# Altium schematic sheet ft600.SchDoc
size A4
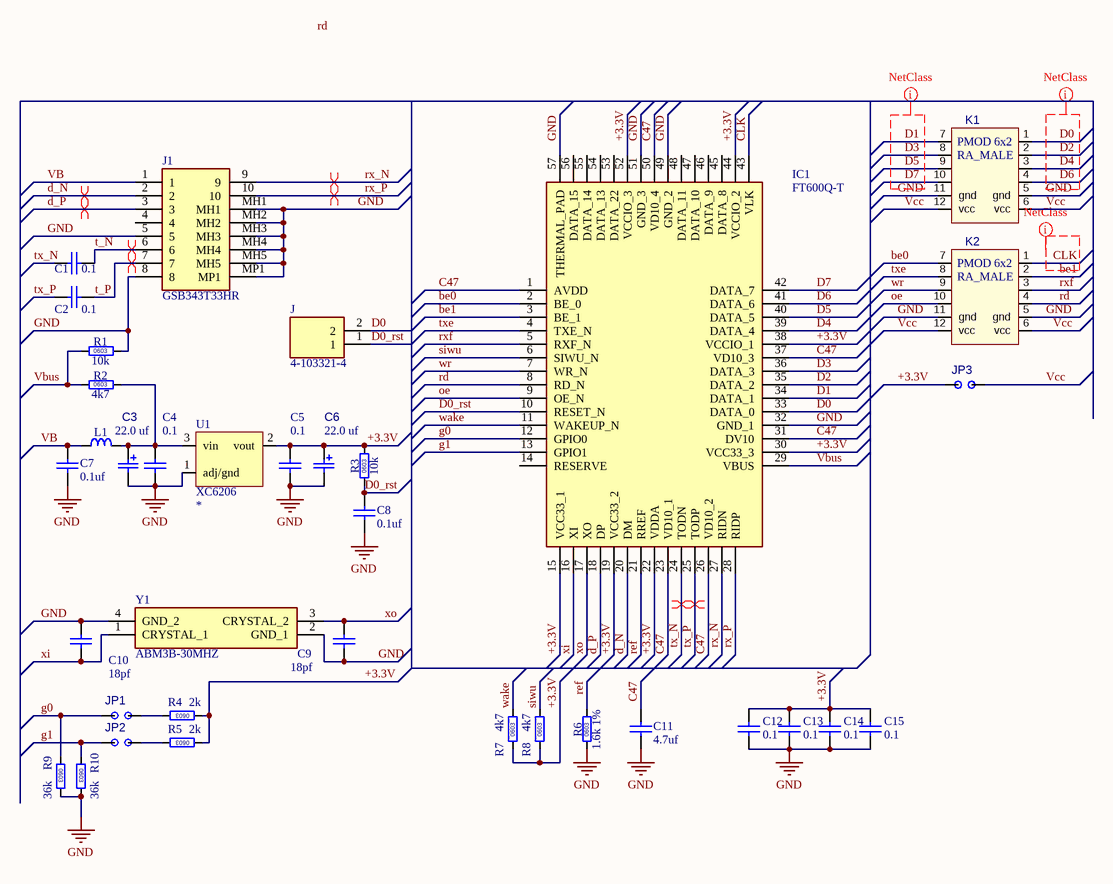
[diagram p0: ft600.SchDoc]

## Parts
C1  value 0.1  [SM0402_3D_cap]  (hidden comment: cap0402)
C2  value 0.1  [SM0402_3D_cap]  (hidden comment: cap0402)
C3  CAP_POL_SMA  [CAP_POL_SMA (3216)]  (value not drawn)
C4  value 0.1  [SM0603 _3D_cap]  (hidden comment: cap0603)
C5  value 0.1  [SM0603 _3D_cap]  (hidden comment: cap0603)
C6  CAP_POL_SMA  [CAP_POL_SMA (3216)]  (value not drawn)
C7  value 0.1uf  [SM0603 _3D_cap]  (hidden comment: cap0603)
C8  value 0.1uf  [SM0603 _3D_cap]  (hidden comment: cap0603)
C9  value 18pf  [SM0603 _3D_cap]  (hidden comment: cap0603)
C10  value 18pf  [SM0603 _3D_cap]  (hidden comment: cap0603)
C11  value 4.7uf  [SM0603 _3D_cap]  (hidden comment: cap0603)
C12  value 0.1  [SM0603 _3D_cap]  (hidden comment: cap0603)
C13  value 0.1  [SM0603 _3D_cap]  (hidden comment: cap0603)
C14  value 0.1  [SM0603 _3D_cap]  (hidden comment: cap0603)
C15  value 0.1  [SM0603 _3D_cap]  (hidden comment: cap0603)
IC1  FT600Q-T  [QFN40P700X700X90-57N-D]
J  4-103321-4  [TE_4-103321-4]
J1  GSB343T33HR  [GSB343T33HR]
JP1  JUMPER2  [JUMPER2]  (value not drawn)
JP2  JUMPER2  [JUMPER2]  (value not drawn)
JP3  JUMPER2  [JUMPER2]  (value not drawn)
K1  PMOD_6x2_ra_male  [PMOD_6x2_right_ANGLE]  (value not drawn)
K2  PMOD_6x2_ra_male  [PMOD_6x2_right_ANGLE]  (value not drawn)
L1  75R@100MHz  [SM0603_3D_res]  (value not drawn)
R1  10k  [SM0603_3D_res]
R2  4k7  [SM0603_3D_res]
R3  10k  [SM0603_3D_res]
R4  2k  [SM0603_3D_res]
R5  2k  [SM0603_3D_res]
R6  1.6k 1%  [SM0603_3D_res]
R7  4k7  [SM0603_3D_res]
R8  4k7  [SM0603_3D_res]
R9  36k  [SM0603_3D_res]
R10  36k  [SM0603_3D_res]
U1  XC6206  [SOT-23]
Y1  ABM3B-30MHZ  [ABM3B]

## Nets
GND: C3.2(b) C4.1 C5.1 C6.2(b) C7.1 C8.1 C9.1 C10.2 C11.1 C12.1 C13.1 C14.1 C15.1 IC1.32(GND_1) IC1.49(GND_2) IC1.51(GND_3) IC1.57(THERMAL_PAD) J1.5 J1.8 J1.MH1 J1.MH2 J1.MH3 J1.MH4 J1.MH5 J1.MP1 K1.5(gnd) K1.11(gnd) K2.5(gnd) K2.11(gnd) R1.2 R6.1 R9.2 R10.2 U1.1(adj/gnd) Y1.2(GND_1) Y1.4(GND_2)
+3.3V: C5.2 C6.1(a) C12.2 C13.2 C14.2 C15.2 IC1.15(VCC33_1) IC1.19(VCC33_2) IC1.22(VDDA) IC1.30(VCC33_3) IC1.38(VCCIO_1) IC1.44(VCCIO_2) IC1.52(VCCIO_3) JP3.2 R3.2 R4.1 R5.1 R7.1 R8.1 U1.2(vout)
be0: IC1.2(BE_0) K2.7
be1: IC1.3(BE_1) K2.2
C47: C11.2 IC1.1(AVDD) IC1.23(VD10_1) IC1.26(VD10_2) IC1.31(DV10) IC1.37(VD10_3) IC1.50(VD10_4)
CLK: IC1.43(VLK) K2.1
D0: IC1.33(DATA_0) J.2 K1.1
D0_rst: C8.2 IC1.10(RESET_N) J.1 R3.1
D1: IC1.34(DATA_1) K1.7
D2: IC1.35(DATA_2) K1.2
D3: IC1.36(DATA_3) K1.8
D4: IC1.39(DATA_4) K1.3
D5: IC1.40(DATA_5) K1.9
D6: IC1.41(DATA_6) K1.4
D7: IC1.42(DATA_7) K1.10
d_N: IC1.20(DM) J1.2
d_P: IC1.18(DP) J1.3
g0: IC1.12(GPIO0) JP1.2 R9.1
g1: IC1.13(GPIO1) JP2.2 R10.1
oe: IC1.9(OE_N) K2.10
rd: IC1.8(RD_N) K2.4
ref: IC1.21(RREF) R6.2
rx_N: IC1.27(RIDN) J1.9
rx_P: IC1.28(RIDP) J1.10
rxf: IC1.5(RXF_N) K2.3
siwu: IC1.6(SIWU_N) R8.2
t_N: C1.1 J1.6
t_P: C2.1 J1.7
tx_N: C1.2 IC1.24(TODN)
tx_P: C2.2 IC1.25(TODP)
txe: IC1.4(TXE_N) K2.8
VB: C7.2 J1.1 L1.1
Vbus: IC1.29(VBUS) R1.1 R2.1
Vcc: JP3.1 K1.6(vcc) K1.12(vcc) K2.6(vcc) K2.12(vcc)
wake: IC1.11(WAKEUP_N) R7.2
wr: IC1.7(WR_N) K2.9
xi: C10.1 IC1.16(XI) Y1.1(CRYSTAL_1)
xo: C9.2 IC1.17(XO) Y1.3(CRYSTAL_2)
NetC3_1: C3.1(a) C4.2 L1.2 R2.2 U1.3(vin)
NetJP1_1: JP1.1 R4.2
NetJP2_1: JP2.1 R5.2

Not connected (* = marked no-connect by the designer): IC1 14(RESERVE) 45(DATA_8) 46(DATA_9) 47(DATA_10) 48(DATA_11) 53(DATA_22) 54(DATA_13) 55(DATA_14) 56(DATA_15); J1 4

## Layout directives
differential pair: d_N, d_P, rx_N, rx_P, t_N, t_P, tx_N, tx_P
net class data: CLK, D0, D1, D2, D3, D4, D5, D6, D7

## Notes on the sheet
- Labels drawn without touching a wire or pin: rd
- (in symbol CAP_POL_SMA) 22.0 uf
- (in symbol PMOD_6x2_ra_male) PMOD 6x2; RA_MALE
- (in symbol Res_0603_EU) 0603

## Library data of the parts
C1 C2 = cap0402: Capacitor  0402 inch; Published: 8-Jun-2000; LatestRevisionDate: 17-Jul-2002; LatestRevisionNote: Re-released for DXP Platform.; PackageReference: RAD-0.3; Publisher: Altium Limited; PackageDescription: Radial Cap, Thru-Hole; 2 Leads; 0.3 in Pin Spacing
C3 C6 = CAP_POL_SMA: CAP_POL_SMA(3216)
C4 C5 C7-C15 = cap0603: Capacitor  0603 inch; Published: 8-Jun-2000; LatestRevisionDate: 17-Jul-2002; LatestRevisionNote: Re-released for DXP Platform.; PackageReference: RAD-0.3; Publisher: Altium Limited; PackageDescription: Radial Cap, Thru-Hole; 2 Leads; 0.3 in Pin Spacing
IC1 = FT600Q-T: Integrated Circuit; Manufacturer_Name: FTDI Chip; Datasheet Link: http://www.farnell.com/datasheets/1975744.pdf; Height: 0.9mm; Manufacturer_Part_Number: FT600Q-T; Mouser Part Number: 895-FT600Q-T; Mouser Price/Stock: https://www.mouser.com/Search/Refine.aspx?Keyword=895-FT600Q-T; Arrow Part Number: FT600Q-T; Arrow Price/Stock: https://www.arrow.com/en/products/ft600q-t/ftdi-chip
J = 4-103321-4: Conn Unshrouded Header HDR 2 POS 2.54mm Solder ST Thru-Hole Carton; MF: TE Connectivity; SnapEDA_Link: https://www.snapeda.com/parts/4-103321-4/TE%20Connectivity%20AMP%20Connectors/view-part/2402753/?ref=snap; Digi-Key_Part_Number: A122847-ND; Value: *; EU_RoHS_Compliance: Compliant; MP: 4-103321-4; Package: None
J1 = GSB343T33HR: Connector; Manufacturer_Name: Amphenol; Datasheet Link: https://componentsearchengine.com/Datasheets/2/GSB343T33HR.pdf; Height: 5.25mm; Manufacturer_Part_Number: GSB343T33HR; Mouser Part Number: 523-GSB343T33HR; Mouser Price/Stock: https://www.mouser.co.uk/ProductDetail/Amphenol-Commercial-Products/GSB343T33HR/?qs=8nwx9VzGl4wjI7K6xpTSyQ%3D%3D; Arrow Part Number: GSB343T33HR; Arrow Price/Stock: https://www.arrow.com/en/products/gsb343t33hr/amphenol
K1 K2 = PMOD_6x2_ra_male: PMOD_6x2_right_angle; Value: *
L1 = chip inductance 0603: Part Number: IND0805_MURATA_BLM21BB750SN1D; Part Description: SMD EMIFIL Suppression Chip Ferrite Bead; Manufacturer: MURATA; Manufacturer Part Number: BLM21BB750SN1D; Power: 700mA; Resistance: 0.16R; Tolerance: ±25%; Table: Inductors SMD; Component Kind: Standard; Component Type: Standard; Footprint: INDC2012X105N; Pin Count: 2; Value: 75R@100MHz; Status: None; Case: 0805; Mounted: Yes; Socket: No; SMD: Yes; ComponentHeight: 1.05mm; Author: S. Jafar; CreateDate: 12/21/2015; LatestRevisionDate: 12/21/2015
R1 R3-R5 R9 R10 = Res_0603_EU: Part Number: R1206_4K7_1%_0.25W_100PPM; Part Description: General Purpose Thick Film Chip Resistor; Manufacturer: GENERIC; Manufacturer1 Part Number: NRC12F4701TRF; Value: 4k7; Power: 0.25W; TC: ±100ppm/°C; Tolerance: ±1%; Table: Resistors SMD; Component Kind: Standard; Component Type: Standard; Footprint: RESC3216X65N; Pin Count: 2; Status: Preferred; Manufacturer Part Number: R1206_4K7_1%_0.25W_100PPM; Case: 1206; Mounted: Yes; Socket: No; SMD: Yes; Manufacturer1 Example: NIC COMPONENT; Manufacturer1 ComponentHeight: 0.65mm; HelpURL: \\cern.ch\dfs\Applications\Altium\Datasheets\R1206_NIC_NRC.pdf; Author: CERN DEM JLC; CreateDate: 12/3/2007; LatestRevisionDate: 3/13/2008
R2 R7 R8 = Res_0603_EU: Part Number: R1206_4K7_1%_0.25W_100PPM; Part Description: General Purpose Thick Film Chip Resistor; Manufacturer: GENERIC; Manufacturer1 Part Number: NRC12F4701TRF; Power: 0.25W; TC: ±100ppm/°C; Tolerance: ±1%; Table: Resistors SMD; Component Kind: Standard; Component Type: Standard; Footprint: RESC3216X65N; Pin Count: 2; Value: 4k7; Status: Preferred; Manufacturer Part Number: R1206_4K7_1%_0.25W_100PPM; Case: 1206; Mounted: Yes; Socket: No; SMD: Yes; Manufacturer1 Example: NIC COMPONENT; Manufacturer1 ComponentHeight: 0.65mm; HelpURL: \\cern.ch\dfs\Applications\Altium\Datasheets\R1206_NIC_NRC.pdf; Author: CERN DEM JLC; CreateDate: 12/3/2007; LatestRevisionDate: 3/13/2008
R6 = Res_0603_EU: Part Number: R1206_4K7_1%_0.25W_100PPM; Part Description: General Purpose Thick Film Chip Resistor; Manufacturer: GENERIC; Manufacturer1 Part Number: NRC12F4701TRF; Value: 4k7; Power: 0.25W; TC: ±100ppm/°C; Table: Resistors SMD; Component Kind: Standard; Component Type: Standard; Footprint: RESC3216X65N; Pin Count: 2; Status: Preferred; Tolerance: ±1%; Manufacturer Part Number: R1206_4K7_1%_0.25W_100PPM; Case: 1206; Mounted: Yes; Socket: No; SMD: Yes; Manufacturer1 Example: NIC COMPONENT; Manufacturer1 ComponentHeight: 0.65mm; HelpURL: \\cern.ch\dfs\Applications\Altium\Datasheets\R1206_NIC_NRC.pdf; Author: CERN DEM JLC; CreateDate: 12/3/2007; LatestRevisionDate: 3/13/2008
U1 = XC6206: SOT-23-3 ldo
Y1 = ABM3B-11.0592MHZ-10-1-U-T: Crystal or Oscillator; Manufacturer_Name: ABRACON; Datasheet Link: https://abracon.com/Resonators/abm3b.pdf; Manufacturer_Part_Number: ABM3B-11.0592MHZ-10-1-U-T; Mouser Part Number: 815-ABM3B-11.0592-T; Mouser Price/Stock: https://www.mouser.co.uk/ProductDetail/ABRACON/ABM3B-110592MHZ-10-1-U-T?qs=LMMkZCEv%2Ff1YUX89OuYUdg%3D%3D; Arrow Part Number: ABM3B-11.0592MHZ-10-1-U-T; Arrow Price/Stock: https://www.arrow.com/en/products/abm3b-11.0592mhz-10-1-u-t/abracon
JP1-JP3 = JUMPER2: Value: *